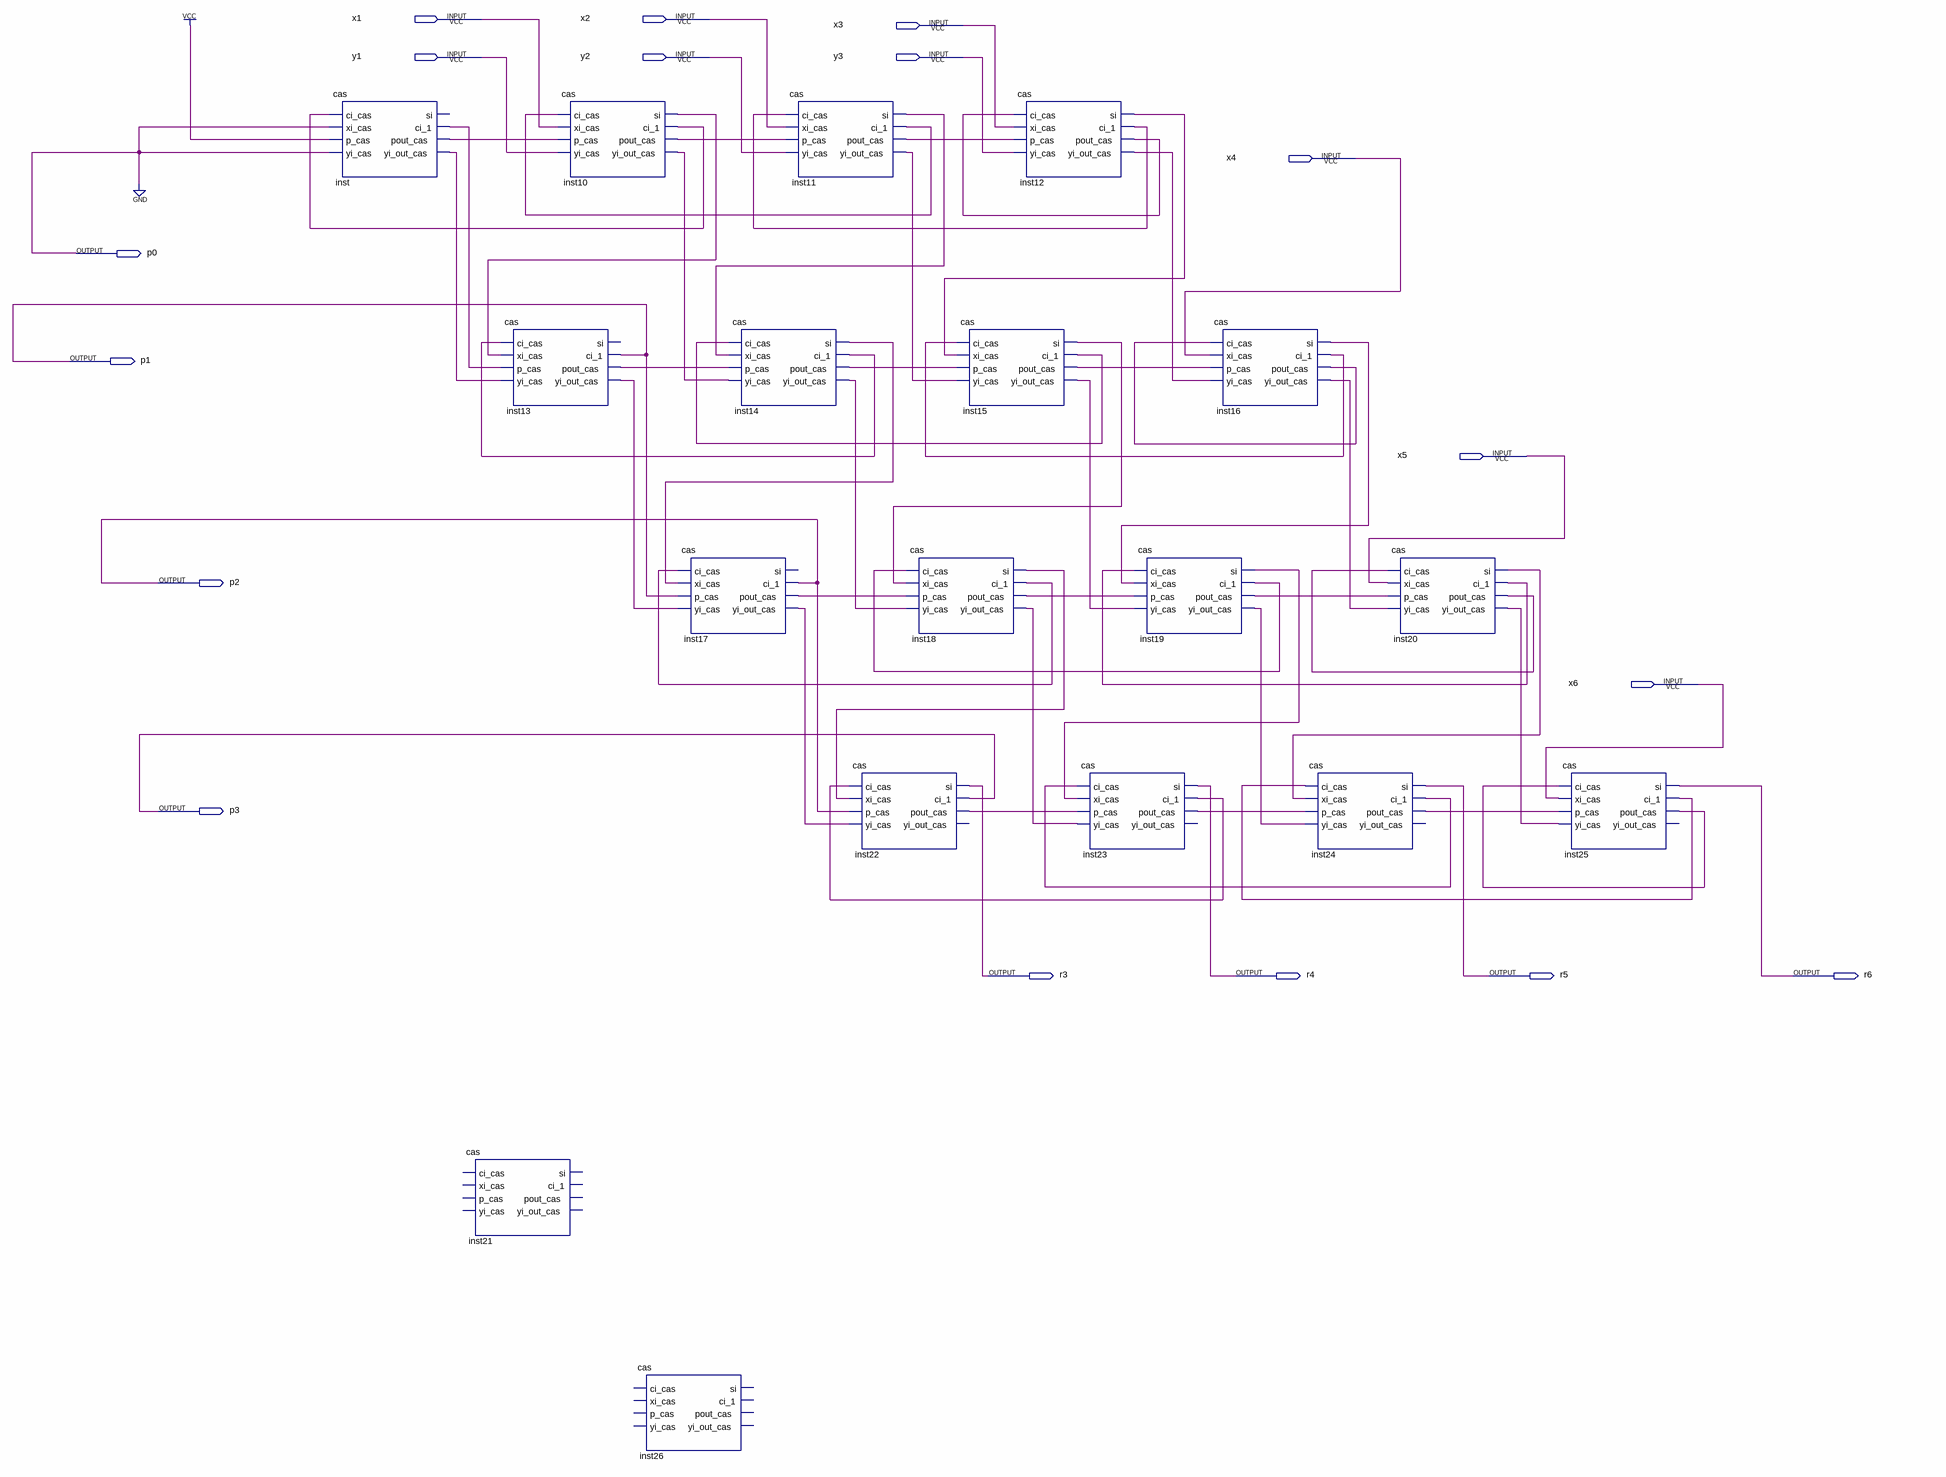
[diagram p0: schematic sheet]
// Quartus schematic div.bdf as structural Verilog: 18 symbols, 17 pins
module div (
  input  x1,
  input  x2,
  input  x3,
  input  y1,
  input  y2,
  input  y3,
  input  x4,
  input  x5,
  input  x6,
  output p0,
  output p1,
  output p2,
  output p3,
  output r3,
  output r4,
  output r5,
  output r6
);

  wire inst10_ci_1, inst10_pout_cas, inst10_si, inst10_yi_out_cas, inst11_ci_1, inst11_pout_cas, inst11_si,
       inst11_yi_out_cas, inst12_ci_1, inst12_pout_cas, inst12_si, inst12_yi_out_cas, inst13_pout_cas,
       inst13_yi_out_cas, inst14_ci_1, inst14_pout_cas, inst14_si, inst14_yi_out_cas, inst15_ci_1,
       inst15_pout_cas, inst15_si, inst15_yi_out_cas, inst16_ci_1, inst16_pout_cas, inst16_si,
       inst16_yi_out_cas, inst17_pout_cas, inst17_yi_out_cas, inst18_ci_1, inst18_pout_cas, inst18_si,
       inst18_yi_out_cas, inst19_ci_1, inst19_pout_cas, inst19_si, inst19_yi_out_cas, inst20_ci_1,
       inst20_pout_cas, inst20_si, inst20_yi_out_cas, inst22_pout_cas, inst23_ci_1, inst23_pout_cas,
       inst24_ci_1, inst24_pout_cas, inst25_ci_1, inst25_pout_cas, inst_ci_1, inst_pout_cas, inst_yi_out_cas;

  cas inst (
    .ci_cas(inst10_ci_1), .xi_cas(1'b0), .p_cas(1'b1), .yi_cas(1'b0), .ci_1(inst_ci_1),
    .pout_cas(inst_pout_cas), .yi_out_cas(inst_yi_out_cas));  // open: si
  cas inst21 ();  // open: ci_cas, xi_cas, p_cas, yi_cas, si, ci_1, pout_cas, yi_out_cas
  cas inst13 (
    .ci_cas(inst14_ci_1), .xi_cas(inst10_si), .p_cas(inst_ci_1), .yi_cas(inst_yi_out_cas), .ci_1(p1),
    .pout_cas(inst13_pout_cas), .yi_out_cas(inst13_yi_out_cas));  // open: si
  cas inst10 (
    .ci_cas(inst11_ci_1), .xi_cas(x1), .p_cas(inst_pout_cas), .yi_cas(y1), .si(inst10_si),
    .ci_1(inst10_ci_1), .pout_cas(inst10_pout_cas), .yi_out_cas(inst10_yi_out_cas));
  cas inst26 ();  // open: ci_cas, xi_cas, p_cas, yi_cas, si, ci_1, pout_cas, yi_out_cas
  cas inst17 (
    .ci_cas(inst18_ci_1), .xi_cas(inst14_si), .p_cas(p1), .yi_cas(inst13_yi_out_cas), .ci_1(p2),
    .pout_cas(inst17_pout_cas), .yi_out_cas(inst17_yi_out_cas));  // open: si
  cas inst14 (
    .ci_cas(inst15_ci_1), .xi_cas(inst11_si), .p_cas(inst13_pout_cas), .yi_cas(inst10_yi_out_cas),
    .si(inst14_si), .ci_1(inst14_ci_1), .pout_cas(inst14_pout_cas), .yi_out_cas(inst14_yi_out_cas));
  cas inst11 (
    .ci_cas(inst12_ci_1), .xi_cas(x2), .p_cas(inst10_pout_cas), .yi_cas(y2), .si(inst11_si),
    .ci_1(inst11_ci_1), .pout_cas(inst11_pout_cas), .yi_out_cas(inst11_yi_out_cas));
  cas inst22 (
    .ci_cas(inst23_ci_1), .xi_cas(inst18_si), .p_cas(p2), .yi_cas(inst17_yi_out_cas), .si(r3), .ci_1(p3),
    .pout_cas(inst22_pout_cas));  // open: yi_out_cas
  cas inst18 (
    .ci_cas(inst19_ci_1), .xi_cas(inst15_si), .p_cas(inst17_pout_cas), .yi_cas(inst14_yi_out_cas),
    .si(inst18_si), .ci_1(inst18_ci_1), .pout_cas(inst18_pout_cas), .yi_out_cas(inst18_yi_out_cas));
  cas inst15 (
    .ci_cas(inst16_ci_1), .xi_cas(inst12_si), .p_cas(inst14_pout_cas), .yi_cas(inst11_yi_out_cas),
    .si(inst15_si), .ci_1(inst15_ci_1), .pout_cas(inst15_pout_cas), .yi_out_cas(inst15_yi_out_cas));
  cas inst12 (
    .ci_cas(inst12_pout_cas), .xi_cas(x3), .p_cas(inst11_pout_cas), .yi_cas(y3), .si(inst12_si),
    .ci_1(inst12_ci_1), .pout_cas(inst12_pout_cas), .yi_out_cas(inst12_yi_out_cas));
  cas inst23 (
    .ci_cas(inst24_ci_1), .xi_cas(inst19_si), .p_cas(inst22_pout_cas), .yi_cas(inst18_yi_out_cas), .si(r4),
    .ci_1(inst23_ci_1), .pout_cas(inst23_pout_cas));  // open: yi_out_cas
  cas inst19 (
    .ci_cas(inst20_ci_1), .xi_cas(inst16_si), .p_cas(inst18_pout_cas), .yi_cas(inst15_yi_out_cas),
    .si(inst19_si), .ci_1(inst19_ci_1), .pout_cas(inst19_pout_cas), .yi_out_cas(inst19_yi_out_cas));
  cas inst16 (
    .ci_cas(inst16_pout_cas), .xi_cas(x4), .p_cas(inst15_pout_cas), .yi_cas(inst12_yi_out_cas),
    .si(inst16_si), .ci_1(inst16_ci_1), .pout_cas(inst16_pout_cas), .yi_out_cas(inst16_yi_out_cas));
  cas inst24 (
    .ci_cas(inst25_ci_1), .xi_cas(inst20_si), .p_cas(inst23_pout_cas), .yi_cas(inst19_yi_out_cas), .si(r5),
    .ci_1(inst24_ci_1), .pout_cas(inst24_pout_cas));  // open: yi_out_cas
  cas inst20 (
    .ci_cas(inst20_pout_cas), .xi_cas(x5), .p_cas(inst19_pout_cas), .yi_cas(inst16_yi_out_cas),
    .si(inst20_si), .ci_1(inst20_ci_1), .pout_cas(inst20_pout_cas), .yi_out_cas(inst20_yi_out_cas));
  cas inst25 (
    .ci_cas(inst25_pout_cas), .xi_cas(x6), .p_cas(inst24_pout_cas), .yi_cas(inst20_yi_out_cas), .si(r6),
    .ci_1(inst25_ci_1), .pout_cas(inst25_pout_cas));  // open: yi_out_cas

  assign p0 = 1'b0;
endmodule
